# EAGLE design Main Board (EAGLE 9.4.2)
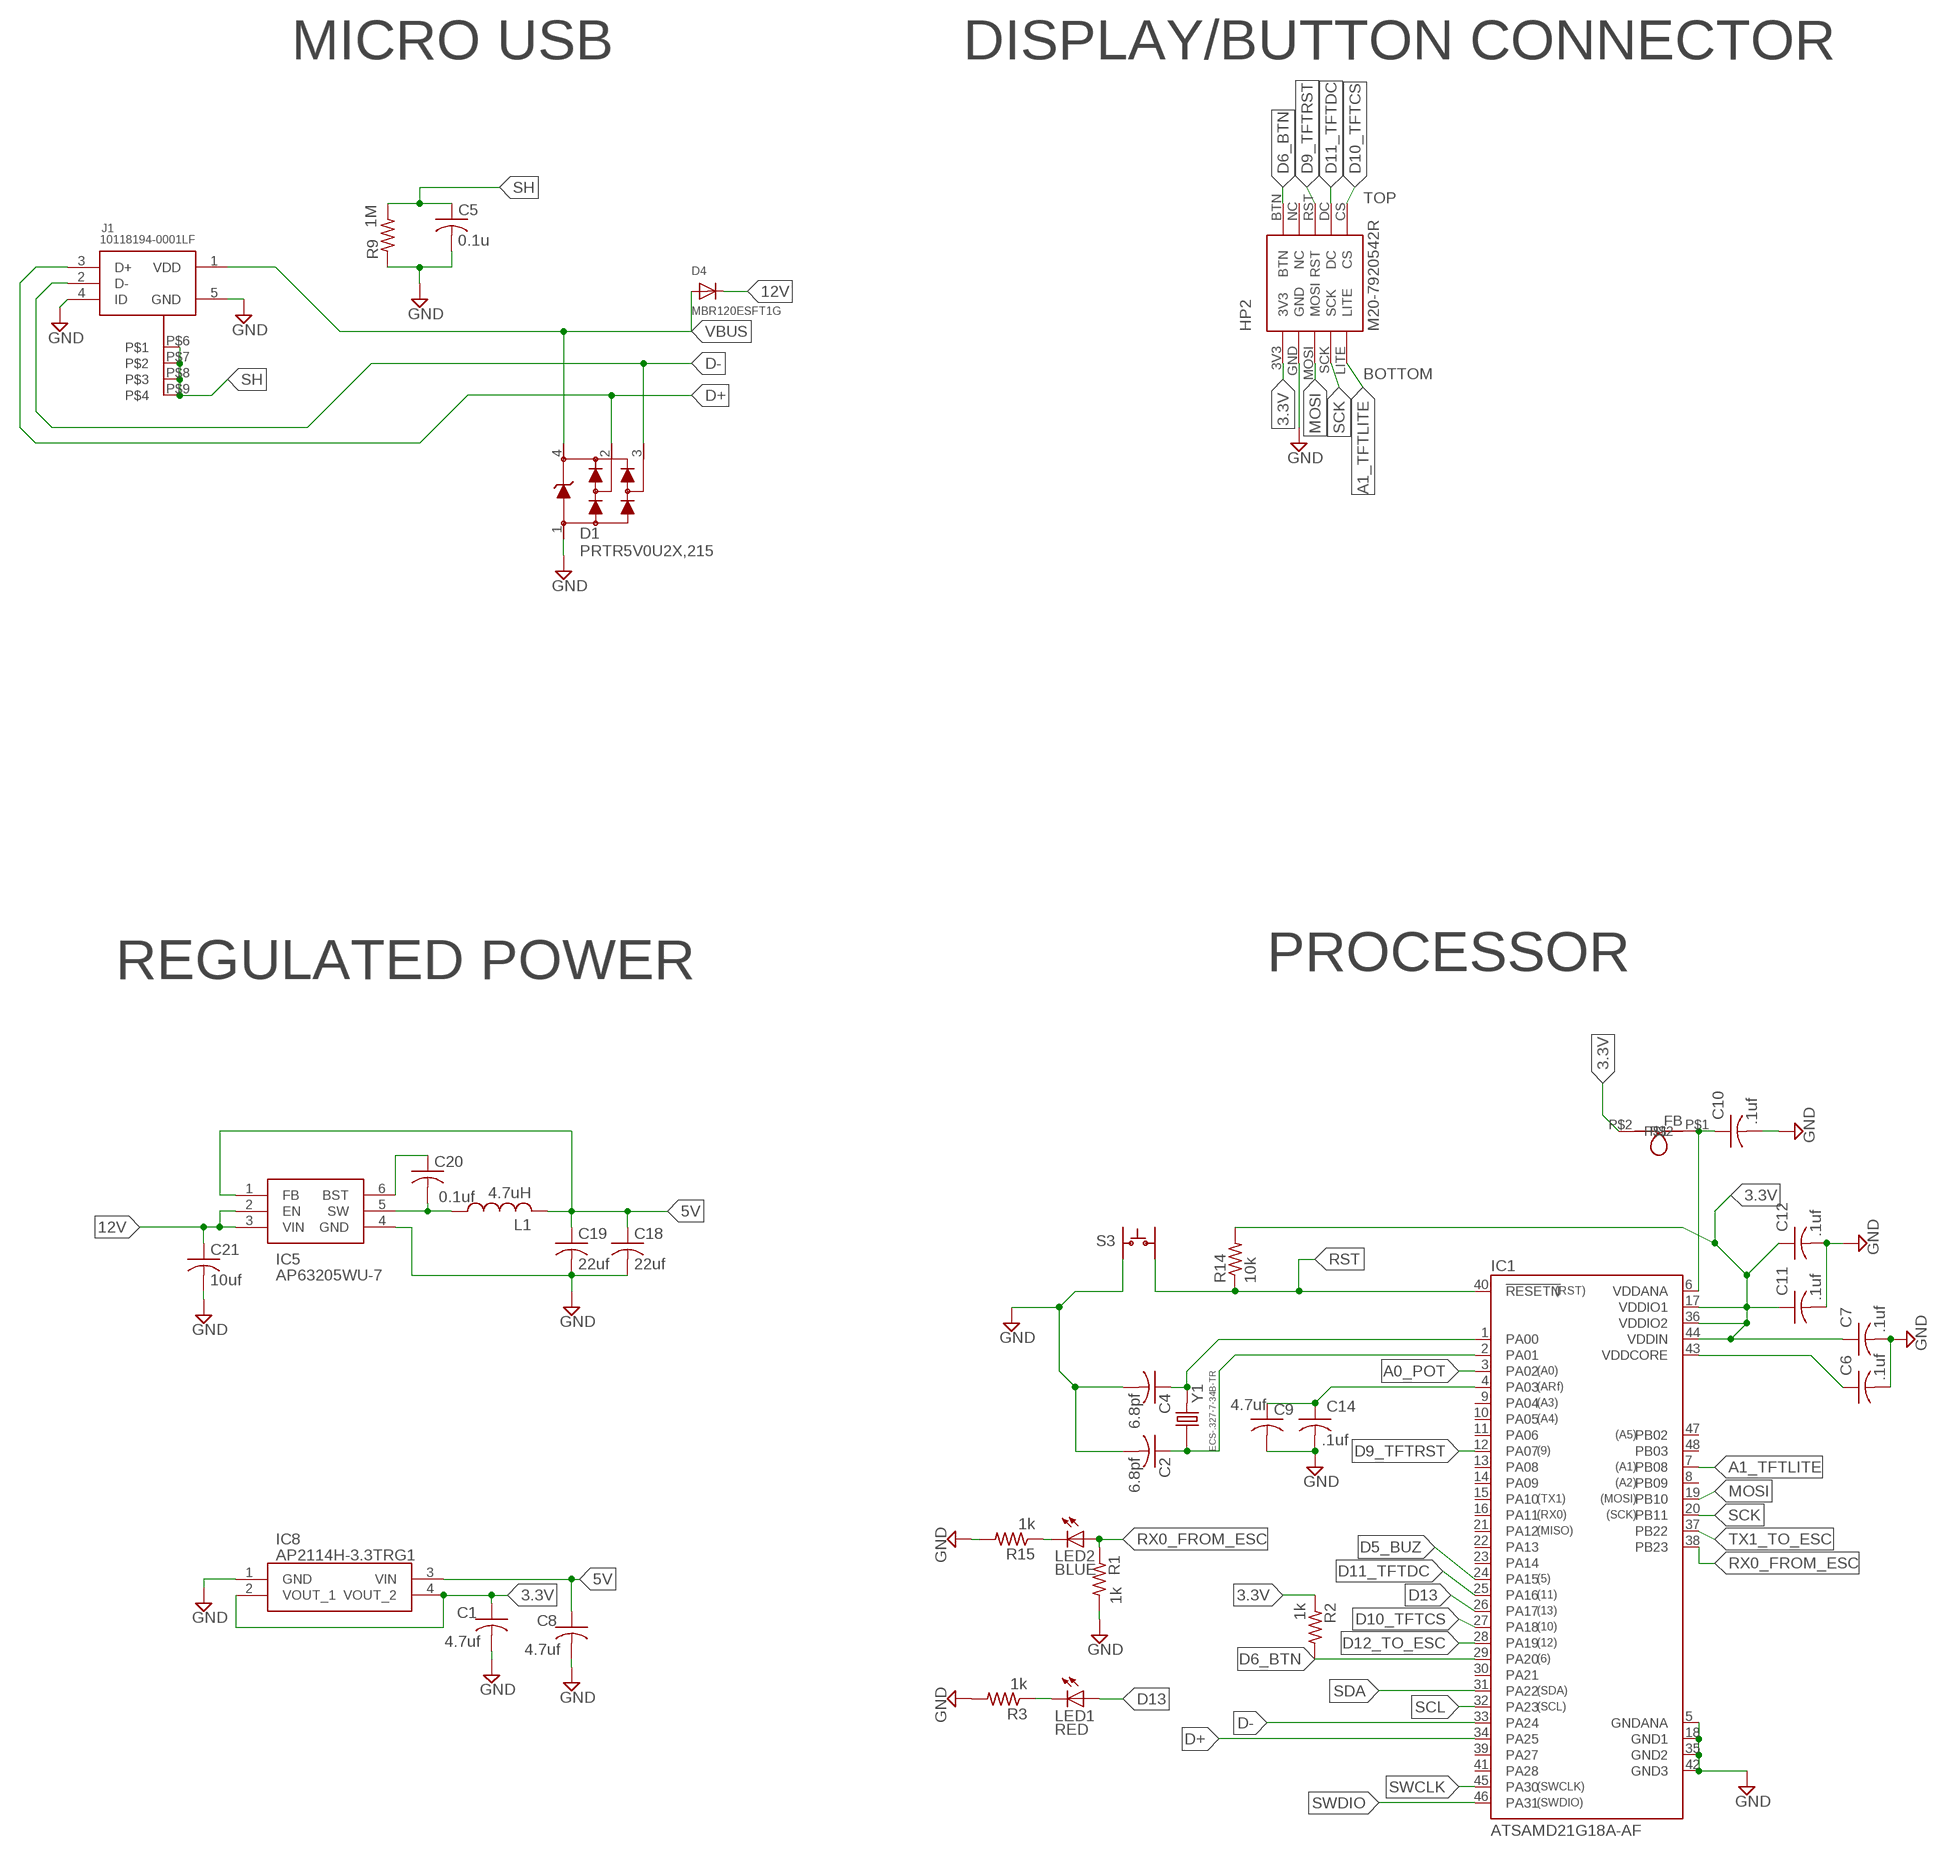
[diagram p0: schematic, sheet 1, part 1 of 2]
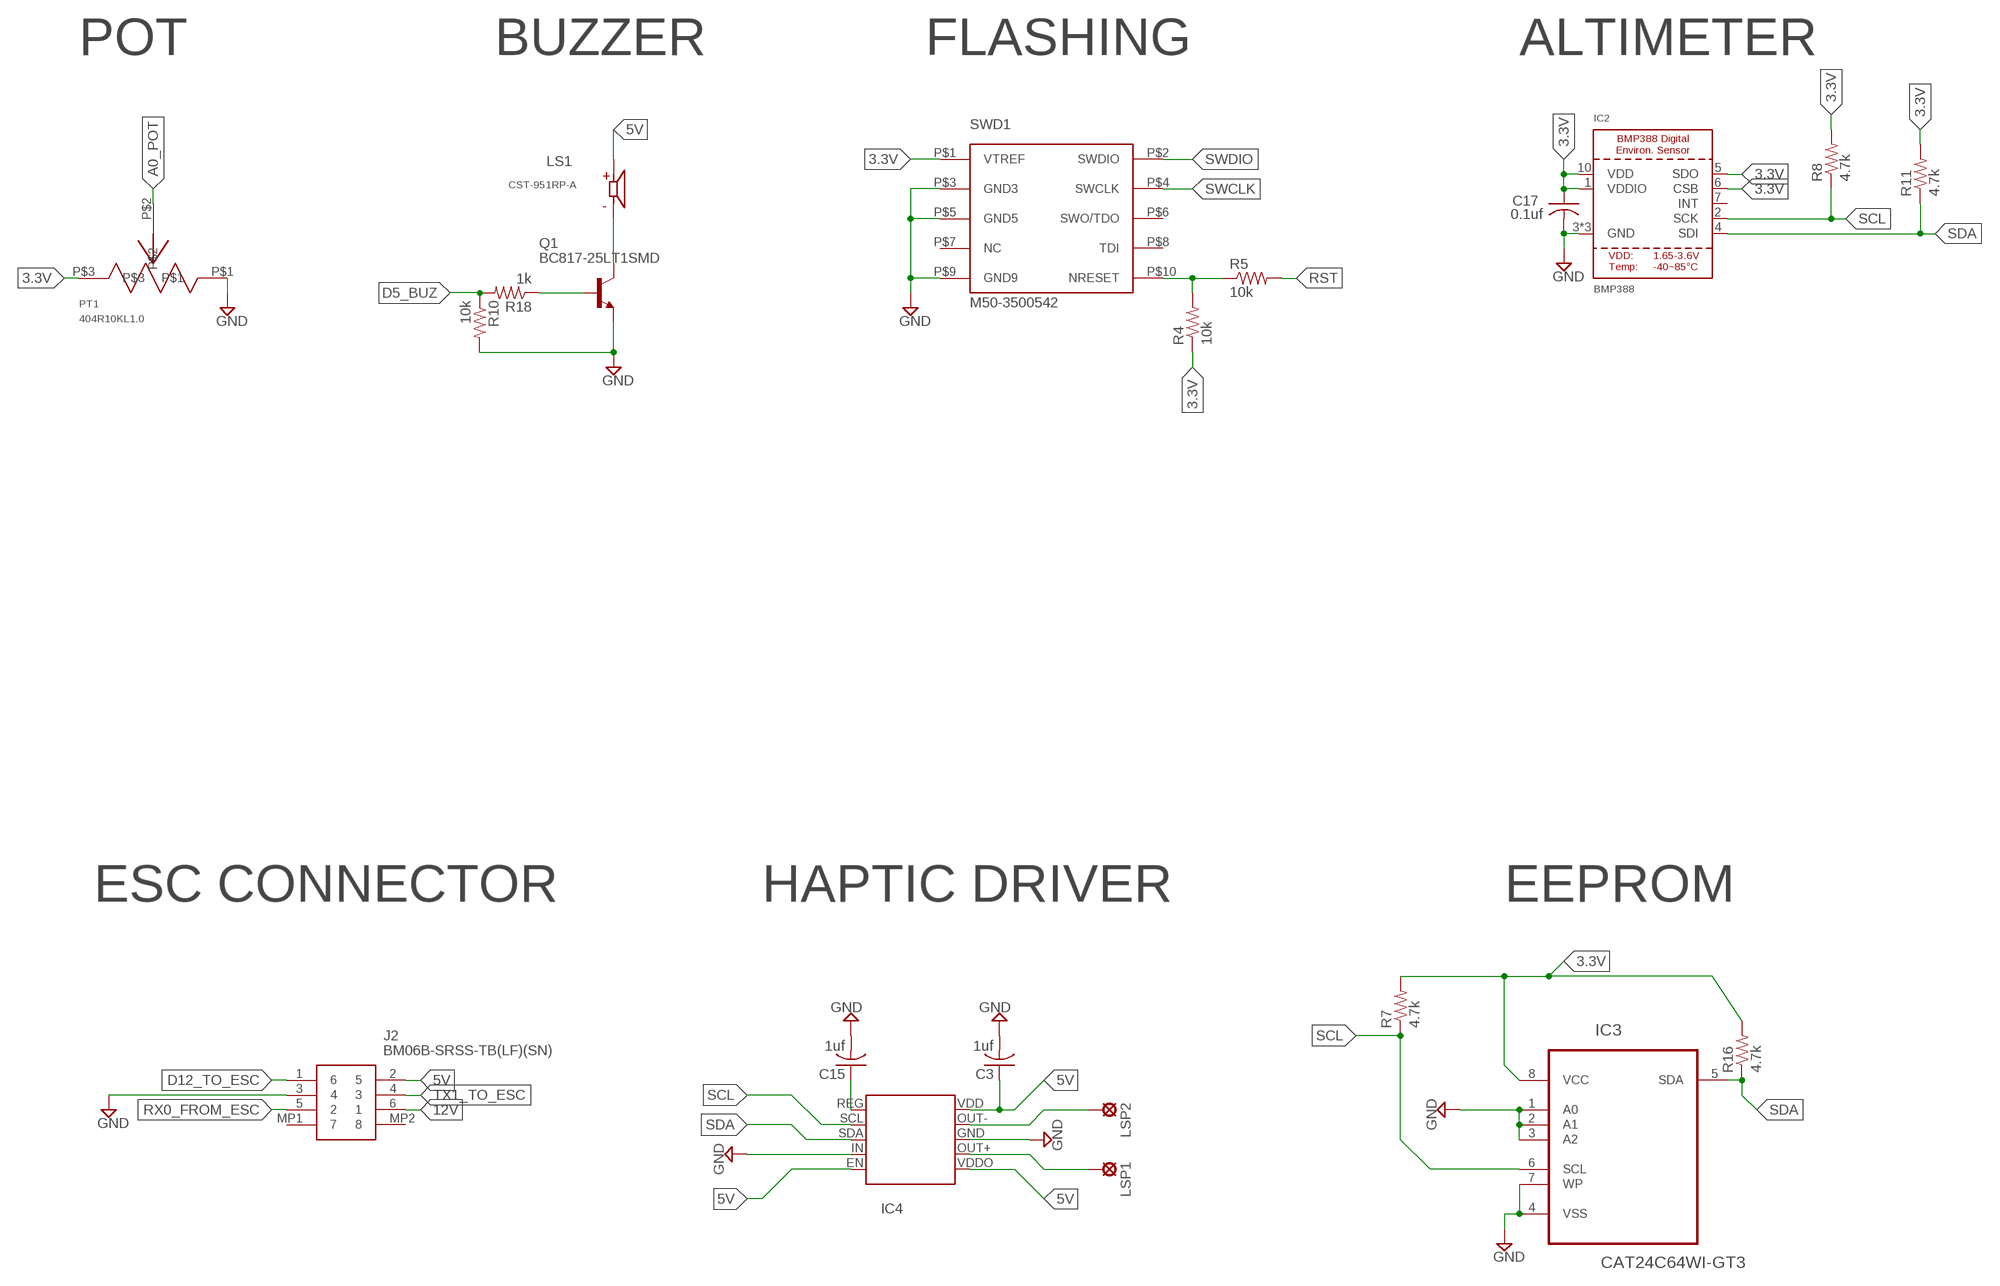
[diagram p1: schematic, sheet 1, part 2 of 2]

## Parts
C1  4.7uf  C-USC0402  [C0402]
C2  6.8pf  C-USC0402  [C0402]
C3  1uf  C-USC0402  [C0402]
C4  6.8pf  C-USC0402  [C0402]
C5  0.1u  C-USC0402  [C0402]
C6  .1uf  C-USC0402  [C0402]
C7  .1uf  C-USC0402  [C0402]
C8  4.7uf  C-USC0402  [C0402]
C9  4.7uf  C-USC0402  [C0402]
C10  .1uf  C-USC0402  [C0402]
C11  .1uf  C-USC0402  [C0402]
C12  .1uf  C-USC0402  [C0402]
C14  .1uf  C-USC0402  [C0402]
C15  1uf  C-USC0402  [C0402]
C17  0.1uf  C-USC0402  [C0402]
C18  22uf  C-USC0603  [C0603]
C19  22uf  C-USC0603  [C0603]
C20  0.1uf  C-USC0402  [C0402]
C21  10uf  C-USC0805  [C0805]
D1  PRTR5V0U2X,215  [SOT143B]
D4  MBR120ESFT1G  DIODE_SOD-123FL  [SOD-123FL]
FB  BLM18PG471SN1D  FERRITE_BEAD  [FERRITE_BEAD]
HP2  M20-7920542R  [M20-7920542R]
IC1  ATSAMD21G18A-AF  [QFP50P900X900X120-48N]
IC2  BMP388  [BMP388]
IC3  CAT24C64WI-GT3  [SOIC127P600X175-8N]
IC4  DRV2605  [DRV2605]
IC5  AP63205WU-7  [SOT95P280X100-6N]
IC8  AP2114H-3.3TRG1  [SOT230P700X180-4N]
J1  10118194-0001LF  [FRAMATOME_10118194-0001LF]
J2  BM06B-SRSS-TB(LF)(SN)  [BM06BSRSSTBLFSN]
L1  4.7uH  L-USL1812  [L1812]
LED1  RED  LEDCHIP-LED0603  [CHIP-LED0603]
LED2  BLUE  LEDCHIP-LED0603  [CHIP-LED0603]
LS1  CST-951RP-A  [CUI_CST-951RP-A]
LSP1  SE14  [SE14]
LSP2  SE14  [SE14]
PT1  404R10KL1.0  [404R10KL1.0]
Q1  BC817-25LT1SMD  [SOT23-BEC]
R1  1k  R-US_R0402  [R0402]
R2  1k  R-US_R0402  [R0402]
R3  1k  R-US_R0402  [R0402]
R4  10k  R-US_R0402  [R0402]
R5  10k  R-US_R0402  [R0402]
R7  4.7k  R-US_R0402  [R0402]
R8  4.7k  R-US_R0402  [R0402]
R9  1M  R-US_R0402  [R0402]
R10  10k  R-US_R0402  [R0402]
R11  4.7k  R-US_R0402  [R0402]
R14  10k  R-US_R0402  [R0402]
R15  1k  R-US_R0402  [R0402]
R16  4.7k  R-US_R0402  [R0402]
R18  1k  R-US_R0402  [R0402]
S3  KMR231NG LFS  TACTILE_SWITCH  [TATILE_SWITCH]
SWD1  M50-3500542  [M50-3500542]
Y1  ECS-.327-7-34B-TR  [XTAL_ECS-.327-12.5-34B-C-TR]

## Nets
3.3V: C1.1 C7.1 C11.1 C12.1 C17.1 FB.P$2 HP2.3V3 IC1.17(VDDIO1) IC1.36(VDDIO2) IC1.44(VDDIN) IC2.1(VDDIO) IC2.5(SDO) IC2.6(CSB) IC2.10(VDD) IC3.8(VCC) IC8.2(VOUT_1) IC8.4(VOUT_2) PT1.P$3 R2.1 R4.1 R7.2 R8.2 R11.2 R14.2 R16.2 SWD1.P$1(VTREF)
5V: C3.1 C8.1 C18.1 C19.1 IC4.EN IC4.VDD IC4.VDDO IC5.1(FB) IC8.3(VIN) J2.2 L1.2 LS1.P
12V: C21.1 D4.C IC5.2(EN) IC5.3(VIN) J2.6
A0_POT: IC1.3(PA02) PT1.P$2
A1_TFTLITE: HP2.LITE IC1.7(PB08)
D5_BUZ: IC1.24(PA15) R10.1 R18.2
D6_BTN: HP2.BTN IC1.29(PA20) R2.2
D9_TFTRST: HP2.RST IC1.12(PA07)
D10_TFTCS: HP2.CS IC1.27(PA18)
D11_TFTDC: HP2.DC IC1.25(PA16)
D12_TO_ESC: IC1.28(PA19) J2.1
D13: IC1.26(PA17) LED1.A
D+: D1.2 IC1.34(PA25) J1.3(D+)
D-: D1.3 IC1.33(PA24) J1.2(D-)
GND: C1.2 C2.2 C3.2 C4.2 C5.2 C6.2 C7.2 C8.2 C9.2 C10.2 C11.2 C12.2 C14.2 C15.2 C17.2 C18.2 C19.2 C21.2 D1.1 HP2.GND IC1.5(GNDANA) IC1.18(GND1) IC1.35(GND2) IC1.42(GND3) IC2.3(GND) IC2.8(GND) IC2.9(GND) IC3.1(A0) IC3.2(A1) IC3.3(A2) IC3.4(VSS) IC3.7(WP) IC4.GND IC4.IN IC5.4(GND) IC8.1(GND) J1.4(ID) J1.5(GND) J2.3 PT1.P$1 Q1.E R1.2 R3.2 R9.1 R10.2 R15.2 S3.P$3 SWD1.P$3(GND3) SWD1.P$5(GND5) SWD1.P$9(GND9)
MOSI: HP2.MOSI IC1.19(PB10)
N$1: C6.1 IC1.43(VDDCORE)
N$2: LED1.C R3.1
N$4: C4.1 IC1.1(PA00) Y1.2
N$6: C2.1 IC1.2(PA01) Y1.1
N$8: C10.1 FB.P$1 IC1.6(VDDANA)
N$9: R4.2 R5.1 SWD1.P$10(NRESET)
N$10: C20.2 IC5.5(SW) L1.1
N$11: C20.1 IC5.6(BST)
N$14: LED2.C R15.1
N$17: IC4.OUT- LSP2.MP
N$24: C9.1 C14.1 IC1.4(PA03)
N$25: Q1.B R18.1
N$26: LS1.M Q1.C
N$27: C15.1 IC4.REG
N$28: IC4.OUT+ LSP1.MP
RST: IC1.40(!RESETN) R5.2 R14.1 S3.P$4
RX0_FROM_ESC: IC1.38(PB23) J2.5 LED2.A R1.1
SCK: HP2.SCK IC1.20(PB11)
SCL: IC1.32(PA23) IC2.2(SCK) IC3.6(SCL) IC4.SCL R7.1 R8.1
SDA: IC1.31(PA22) IC2.4(SDI) IC3.5(SDA) IC4.SDA R11.1 R16.1
SH: C5.1 J1.P$6 J1.P$7 J1.P$8 J1.P$9 R9.2
SWCLK: IC1.45(PA30) SWD1.P$4(SWCLK)
SWDIO: IC1.46(PA31) SWD1.P$2(SWDIO)
TX1_TO_ESC: IC1.37(PB22) J2.4
VBUS: D1.4 D4.A J1.1(VDD)
Unconnected: HP2.NC IC1.8(PB09) IC1.9(PA04) IC1.10(PA05) IC1.11(PA06) IC1.13(PA08) IC1.14(PA09) IC1.15(PA10) IC1.16(PA11) IC1.21(PA12) IC1.22(PA13) IC1.23(PA14) IC1.30(PA21) IC1.39(PA27) IC1.41(PA28) IC1.47(PB02) IC1.48(PB03) IC2.7(INT) J2.MP1 J2.MP2 S3.P$1 S3.P$2 SWD1.P$6(SWO/TDO) SWD1.P$7(NC) SWD1.P$8(TDI)

## Notes on the sheet
- MICRO USB | DISPLAY/BUTTON CONNECTOR | POT | BUZZER | FLASHING | ALTIMETER
- REGULATED POWER | PROCESSOR | ESC CONNECTOR | HAPTIC DRIVER | EEPROM

## Library data of the parts
C1-C12 C14 C15 C17-C21 = rcl:C-US: CAPACITOR, American symbol; SPICEPREFIX: C
D1 = PRTR5V0U2X_215:PRTR5V0U2X,215: Ultra low capacitance double rail-to-rail ESD protection diode; AVAILABILITY: Good; DESCRIPTION: PRTR5V0U2X - Ultra low capacitance double rail-to-rail ESD protection diode; MF: Nexperia; MP: PRTR5V0U2X,215; PACKAGE: SOT-143 Nexperia; PRICE: 0.26 USD
D4 = adafruit:DIODE: Diode SMADIODE - SMA Surface Mount Package 20V 1A Schottky Diode Digikey: 641-1014-6-ND DO-1N4148 - Through Hole Small Current Diode SOD-123 20V 1 A (.5mV Vf) Schottky Diode - Digikey: MBRX120TPMSCT-ND SOD-323 10V 570mA (.38mV Vf, 3ns) Schottky Diode - Digikey: ZLLS410CT-ND SOD-523 30V 30mA Schottky Diode (RB751S-40TE61) - Digikey: RB751S-40TE61CT-ND SOT23-R/W - SOT23 Package (R = Solder Paste/Reflow Ovens, W = Hand-Soldering) BAT54Film 40V 300mA - Digikey: 497-7162-1-ND
FB = Cucchiara:FERRITE_BEAD
HP2 = M20-7920542R:M20-7920542R
IC1 = ATSAMD21G18A-AF:ATSAMD21G18A-AF: Cortex-M0+, 256KB FLASH, 32KB SRAM, USB, DMA, T&R - 48TQFP IND TEMP, GREEN, 1.6-3.6V, 48MHz; DESCRIPTION: MCU 32-Bit SAM D21G ARM Cortex M0+ RISC 256KB Flash 3.3V 48-Pin TQFP Tray; DIGI-KEY_PART_NUMBER: ATSAMD21G18A-AF-ND; DIGI-KEY_PURCHASE_URL: https://www.digikey.com/product-detail/en/microchip-technology/ATSAMD21G18A-AF/ATSAMD21G18A-AF-ND/5057238?utm_source=snapeda&utm_medium=aggregator&utm_campaign=symbol; MF: Microchip; MP: ATSAMD21G18A-AF; PACKAGE: TQFP-48 Microchip
IC2 = microbuilder:BMP388
IC3 = CAT24C64WI-GT3:CAT24C64WI-GT3: 64 kb I2C CMOS Serial EEPROM; AVAILABILITY: Unavailable; DESCRIPTION: CAT24C64 Series 64 Kb _8K X 8_ 1.8 - 5.5 V I2C CMOS Serial EEPROM - SOIC-8; MF: ON Semiconductor; MP: CAT24C64WI-GT3; PACKAGE: SOIC-8 ON Semiconductor; PRICE: None
IC4 = Zachs E libraries:DRV2605
IC5 = AP63205WU-7:AP63205WU-7: Switching Voltage Regulators DCDC Conv HV Buck TSOT26 T&R 3K Source: Datasheet <https://www.diodes.com/assets/Datasheets/AP63200-AP63201-AP63203-AP63205.pdf>; DESCRIPTION: Switching Voltage Regulators DCDC Conv HV Buck TSOT26 T&R 3K; HEIGHT: 1mm; MANUFACTURER_NAME: Diodes Inc.; MANUFACTURER_PART_NUMBER: AP63205WU-7; MOUSER_PART_NUMBER: 621-AP63205WU-7; MOUSER_PRICE-STOCK: https://www.mouser.com/Search/Refine.aspx?Keyword=621-AP63205WU-7
IC8 = AP2114H-3.3TRG1:AP2114H-3.3TRG1: 1A 3.3V Low Noise LDO Regulator SOT223 DiodesZetex AP2114H-3.3TRG1, LDO Voltage Regulator, 1 (Min)A, 3.3 V +/-1.5%, 2.5 6 Vin, 3-Pin SOT-223 Source: Datasheet <http://uk.rs-online.com/web/p/products/8283528>; ALLIED_NUMBER: 70550988; ALLIED_PRICE-STOCK: https://www.alliedelec.com/diodes-inc-ap2114h-3-3trg1/70550988/; DESCRIPTION: 1A 3.3V Low Noise LDO Regulator SOT223 DiodesZetex AP2114H-3.3TRG1, LDO Voltage Regulator, 1 (Min)A, 3.3 V +/-1.5%, 2.5 6 Vin, 3-Pin SOT-223; HEIGHT: 1.8mm; MANUFACTURER_NAME: Diodes Inc.; MANUFACTURER_PART_NUMBER: AP2114H-3.3TRG1; MOUSER_PART_NUMBER: 621-AP2114H-3.3TRG1; MOUSER_PRICE-STOCK: https://www.mouser.com/Search/Refine.aspx?Keyword=621-AP2114H-3.3TRG1; RS_PART_NUMBER: 8283528P; RS_PRICE-STOCK: http://uk.rs-online.com/web/p/products/8283528P
J1 = 10118194-0001LF:10118194-0001LF: Conn Micro USB Type B RCP 5 POS 0.65mm Solder RA SMD 5 Terminal 1 Port T/R; AVAILABILITY: Unavailable; DESCRIPTION: Micro Usb, 2.0 Type b, Rcpt, Smt; MF: Amphenol FCI; MP: 10118194-0001LF; PACKAGE: None; PRICE: None
J2 = BM06B-SRSS-TB(LF)(SN):BM06B-SRSS-TB(LF)(SN): connector,multipole PCB use,BM06B-SRSS-T JST SH Series, 1mm Pitch 6 Way 1 Row Straight PCB Header, Solder Termination, 1A Source: Datasheet <http://docs-emea.rs-online.com/webdocs/13ce/0900766b813ce45e.pdf>; DESCRIPTION: connector,multipole PCB use,BM06B-SRSS-T JST SH Series, 1mm Pitch 6 Way 1 Row Straight PCB Header, Solder Termination, 1A; HEIGHT: 4.25mm; MANUFACTURER_NAME: JST (JAPAN SOLDERLESS TERMINALS); MANUFACTURER_PART_NUMBER: BM06B-SRSS-TB(LF)(SN); RS_PART_NUMBER: 5468782; RS_PRICE-STOCK: http://uk.rs-online.com/web/p/products/5468782
L1 = rcl:L-US: INDUCTOR, American symbol; SPICEPREFIX: L
LED1 LED2 = led:LED: LED OSRAM: - CHIPLED LG R971, LG N971, LY N971, LG Q971, LY Q971, LO R971, LY R971 LH N974, LH R974 LS Q976, LO Q976, LY Q976 LO Q996 - Hyper CHIPLED LW Q18S LB Q993, LB Q99A, LB R99A - SideLED LS A670, LO A670, LY A670, LG A670, LP A670 LB A673, LV A673, LT A673, LW A673 LH A674 LY A675 LS A676, LA A676, LO A676, LY A676, LW A676 LS A679, LY A679, LG A679 - Hyper Micro SIDELED® LS Y876, LA Y876, LO Y876, LY Y876 LT Y87S - SmartLED LW L88C, LW L88S LB L89C, LB L89S, LG L890 LS L89K, LO L89K, LY L89K LS L896, LA L896, LO L896, LY L896 - TOPLED LS T670, LO T670, LY T670, LG T670, LP T670 LSG T670, LSP T670, LSY T670, LOP T670, LYG T670 LG T671, LOG T671, LSG T671 LB T673, LV T673, LT T673, LW T673 LH T674 LS T676, LA T676, LO T676, LY T676, LB T676, LH T676, LSB T676, LW T676 LB T67C, LV T67C, LT T67C, LS T67K, LO T67K, LY T67K, LW E67C LS E67B, LA E67B, LO E67B, LY E67B, LB E67C, LV E67C, LT E67C LW T67C LS T679, LY T679, LG T679 LS T770, LO T770, LY T770, LG T770, LP T770 LB T773, LV T773, LT T773, LW T773 LH T774 LS E675, LA E675, LY E675, LS T675 LS T776, LA T776, LO T776, LY T776, LB T776 LHGB T686 LT T68C, LB T68C - Hyper Mini TOPLED® LB M676 - Mini TOPLED Santana® LG M470 LS M47K, LO M47K, LY M47K Source: http://www.osram.convergy.de LUXEON: - LUMILED® LXK2-PW12-R00, LXK2-PW12-S00, LXK2-PW14-U00, LXK2-PW14-V00 LXK2-PM12-R00, LXK2-PM12-S00, LXK2-PM14-U00 LXK2-PE12-Q00, LXK2-PE12-R00, LXK2-PE12-S00, LXK2-PE14-T00, LXK2-PE14-U00 LXK2-PB12-K00, LXK2-PB12-L00, LXK2-PB12-M00, LXK2-PB14-N00, LXK2-PB14-P00, LXK2-PB14-Q00 LXK2-PR12-L00, LXK2-PR12-M00, LXK2-PR14-Q00, LXK2-PR14-R00 LXK2-PD12-Q00, LXK2-PD12-R00, LXK2-PD12-S00 LXK2-PH12-R00, LXK2-PH12-S00 LXK2-PL12-P00, LXK2-PL12-Q00, LXK2-PL12-R00 Source: www.luxeon.com KINGBRIGHT: KA-3528ASYC Source: www.kingbright.com
LS1 = CST-951RP-A:CST-951RP-A: 9 mm, 5 V, 85 dB, Through Hole, Side Port, Magnetic Audio Transducer Buzzer; AVAILABILITY: Unavailable; CUI_PURCHASE_URL: https://www.cui.com/product/audio/buzzers/audio-transducers/magnetic/cst-951rp-a?utm_source=snapeda.com&utm_medium=referral&utm_campaign=snapedaBOM; DESCRIPTION: 9 mm, 5 V, 85 dB, Through Hole, Side Port, Magnetic Audio Transducer Buzzer; MF: CUI Inc.; MP: CST-951RP-A; PACKAGE: CUI; PRICE: None
LSP1 LSP2 = solpad:SE14: SOLDER PAD E1553, drill 1,4mm, distributor Buerklin, 07F820
PT1 = 404R10KL1.0:404R10KL1.0; POT: 10K
Q1 = transistor-npn:BC817*: NPN Transistor
R1-R5 R7-R11 R14-R16 R18 = rcl:R-US_: RESISTOR, American symbol; SPICEPREFIX: R
S3 = Zachs E libraries:TACTILE_SWITCH
SWD1 = Braedin's Eagle Libraries:M50-3500542; SWD: M50-3500542
Y1 = ECS-.327-7-34B-TR:ECS-.327-7-34B-TR: Crystal 2-SMD, No Lead; AVAILABILITY: Good; DESCRIPTION: ECX-31B Series 32.768 kHz ±20 ppm 7 pF -40 to +85 °C SMT Tuning Fork Crystal; MF: ECS International; MP: ECS-.327-7-34B-TR; PACKAGE: SMD-2 ECS International; PRICE: 0.45 USD

## Net classes
0 default: width 0.152 mm
1 3.3V: width 0.254 mm
3 GND: width 0.254 mm

## Board
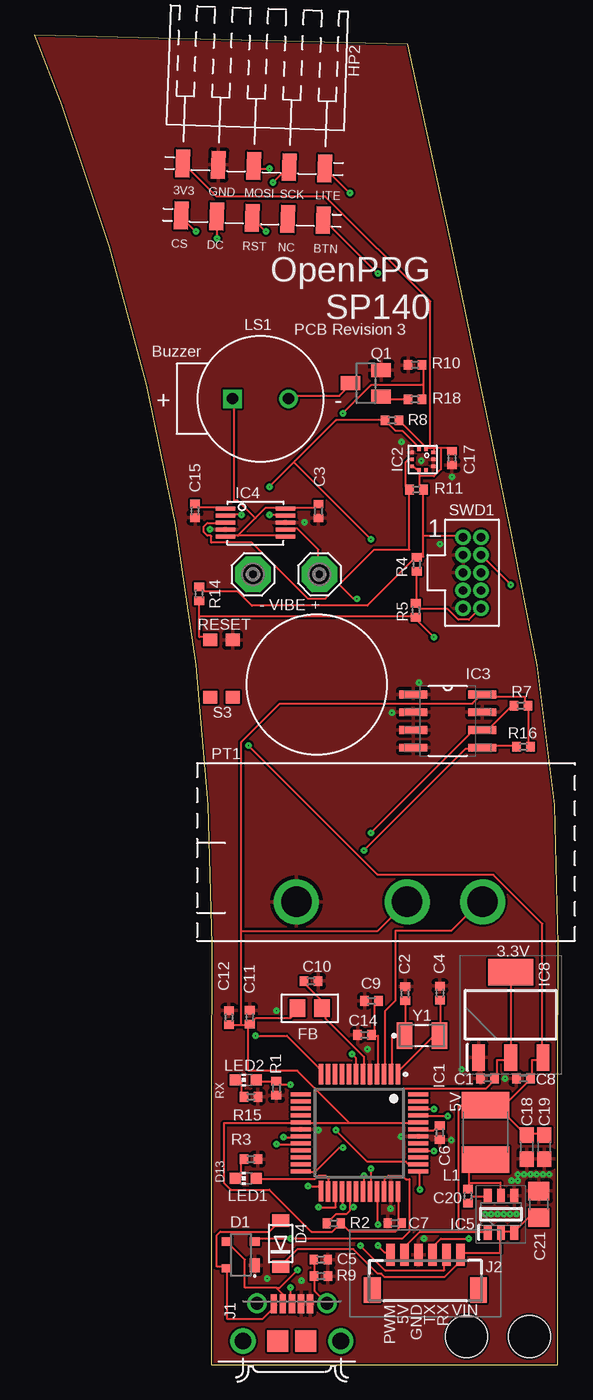
[diagram p2: board, top side]
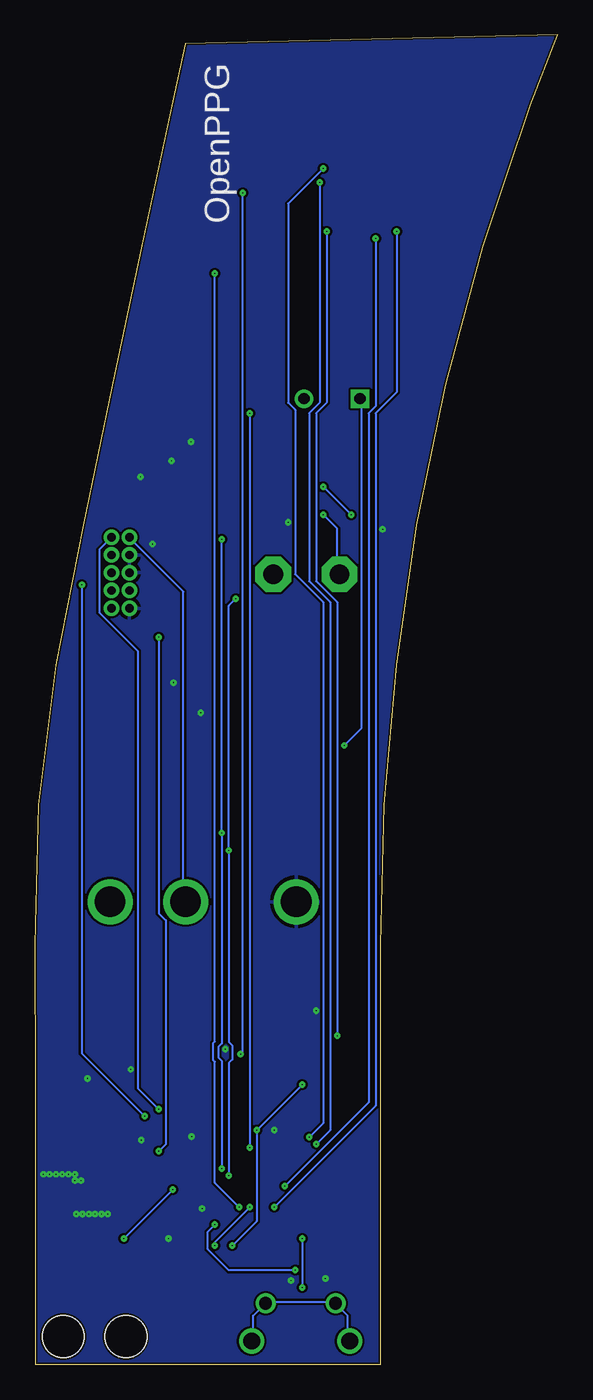
[diagram p3: board, bottom side, seen from below]

Size 37.35 x 95.05 mm. Coordinates in mm from the lower left corner, seen from the top.
Outline: 0,95.05 26.6,94.4 27.57,90 29.73,80 31.83,70 33.88,60 35.87,50 37.1,40 37.35,30 37.33,20 37.33,0 12.63,0 12.63,20 12.65,30 12.37,40 11.51,50 10.05,60 7.99,70 5.3,80 1.95,90 0,95.05
Copper layers (1*16): Top 0.035mm / dielectric 1.5mm / Bottom 0.035mm
Design rules "default *": minimum track width 2mil, minimum drill 2mil, track to track 6mil, track to pad 6mil, pad to pad 6mil, via to via 6mil, smd to smd 6mil, copper to edge 0.149859375mm, drill to drill 8mil, minimum pad ring 10mil, minimum via ring 8mil, stop-mask expansion 3mil, vias tented up to drill 0mil, thermal gap 10mil
Holes 3 mm at 30.85,2 35.33,2

### Footprints (pad centres in the part's own frame; a part is rotated, then mirrored left to right if it is on the bottom)
C0402 = smd 0.6 x 0.7: 1 -0.5,0; 2 0.5,0
C0603 = smd 1.1 x 1: 1 -0.85,0; 2 0.85,0
C0805 = smd 1.3 x 1.5: 1 -0.95,0; 2 0.95,0
SOT143B = smd 1 x 0.7: 1 -0.75,-1 | smd 0.6 x 0.7: 2 0.95,-1; 3 0.95,1; 4 -0.95,1
SOD-123FL = smd 0.91 x 1.22: A 1.637,0; C -1.637,0
FERRITE_BEAD = smd 1.1 x 1.25: P$1 -0.875,0; P$2 0.875,0
M20-7920542R = smd 1 x 2: 3V3 0,4.125; BTN 10.16,0.425; CS 0,0.425; DC 2.54,0.425; GND 2.54,4.125; LITE 10.16,4.125; MOSI 5.08,4.125; NC 7.62,0.425; RST 5.08,0.425; SCK 7.62,4.125
QFP50P900X900X120-48N = smd 1.45 x 0.3: 1 -4.2,2.75; 2 -4.2,2.25; 3 -4.2,1.75; 4 -4.2,1.25; 5 -4.2,0.75; 6 -4.2,0.25; 7 -4.2,-0.25; 8 -4.2,-0.75; 9 -4.2,-1.25; 10 -4.2,-1.75; 11 -4.2,-2.25; 12 -4.2,-2.75; 25 4.17,-2.75; 26 4.2,-2.25; 27 4.2,-1.75; 28 4.2,-1.25; 29 4.2,-0.75; 30 4.2,-0.25; 31 4.2,0.25; 32 4.2,0.75; 33 4.2,1.25; 34 4.2,1.75; 35 4.2,2.25; 36 4.2,2.75 | smd 0.3 x 1.45: 13 -2.75,-4.2; 14 -2.25,-4.2; 15 -1.75,-4.2; 16 -1.25,-4.2; 17 -0.75,-4.2; 18 -0.25,-4.2; 19 0.25,-4.2; 20 0.75,-4.2; 21 1.25,-4.2; 22 1.75,-4.2; 23 2.25,-4.2; 24 2.75,-4.2; 37 2.75,4.2; 38 2.25,4.2; 39 1.75,4.2; 40 1.25,4.2; 41 0.75,4.2; 42 0.25,4.2; 43 -0.25,4.2; 44 -0.75,4.2; 45 -1.25,4.2; 46 -1.75,4.2; 47 -2.25,4.2; 48 -2.75,4.2
BMP388 = smd 0.25 x 0.275: 1 0.25,0.75; 2 -0.25,0.75; 6 -0.25,-0.75; 7 0.25,-0.75 | smd 0.275 x 0.25: 3 -0.762,0.5; 4 -0.762,0; 5 -0.762,-0.5; 8 0.762,-0.5; 9 0.762,0; 10 0.762,0.5
SOIC127P600X175-8N = smd 1.981 x 0.559: 1 -2.464,1.905; 2 -2.464,0.635; 3 -2.464,-0.635; 4 -2.464,-1.905; 5 2.464,-1.905; 6 2.464,-0.635; 7 2.464,0.635; 8 2.464,1.905
DRV2605 = smd 1.4 x 0.28: EN -2.14,-1; GND 2.14,0; IN -2.14,-0.5; OUT+ 2.14,-0.5; OUT- 2.14,0.5; REG -2.14,1; SCL -2.14,0.5; SDA -2.14,0; VDD 2.14,1; VDDO 2.14,-1
SOT95P280X100-6N = smd 1.05 x 0.55: 1 -1.3,0.95; 2 -1.3,0; 3 -1.3,-0.95; 4 1.3,-0.95; 5 1.3,0; 6 1.3,0.95
SOT230P700X180-4N = smd 1.9 x 0.9: 1 -3.05,2.3; 2 -3.05,0; 3 -3.05,-2.3 | smd 1.9 x 3.2: 4 3.05,0
FRAMATOME_10118194-0001LF = smd 0.45 x 1.35: 1 -1.3,2.675; 2 -0.65,2.675; 3 0,2.675; 4 0.65,2.675; 5 1.3,2.675 | drill 0.9: P$6 -2.5,2.7; P$7 2.5,2.7 | drill 1.2: P$8 -3.5,0; P$9 3.5,0 | smd 1.5 x 1.55: P$10 -1,0; P$11 1,0
BM06BSRSSTBLFSN = smd 0.6 x 1.55: 1 2.5,-1.65; 2 1.5,-1.65; 3 0.5,-1.65; 4 -0.5,-1.65; 5 -1.5,-1.65; 6 -2.5,-1.65 | smd 1.2 x 1.8: MP1 -3.8,0.875; MP2 3.8,0.875
L1812 = smd 1.9 x 3.4: 1 -1.95,0; 2 1.95,0
CHIP-LED0603 = smd 0.8 x 0.8: A 0,-0.75; C 0,0.75
CUI_CST-951RP-A = drill 0.8: M 2,0 | drill 0.8 square: P -2,0
SE14 = drill 1.397 pad 2.54 octagon: MP 0,0
404R10KL1.0 = drill 2.2: P$1 7.1,2.8; P$2 20.4,2.8; P$3 15,2.8
SOT23-BEC = smd 1 x 1.4: B -0.95,-1.1; C 0,1.1; E 0.95,-1.1
R0402 = smd 0.6 x 0.7: 1 -0.5,0; 2 0.5,0
TATILE_SWITCH = smd 0.9 x 1: P$1 2.05,0.8; P$2 2.05,-0.8; P$3 -2.05,0.8; P$4 -2.05,-0.8
M50-3500542 = drill 0.6: P$1 0,2.54; P$2 1.27,2.54; P$3 0,1.27; P$4 1.27,1.27; P$5 0,0; P$6 1.27,0; P$7 0,-1.27; P$8 1.27,-1.27; P$9 0,-2.54; P$10 1.27,-2.54
XTAL_ECS-.327-12.5-34B-C-TR = smd 1.1 x 1.9: 1 -1.25,0; 2 1.25,0

### Placement (x,y rotation side)
C1  32.35,20.45 180 top
C2  26.45,26.52 90 top
C3  20.26,61.01 270 top
C4  28.94,26.55 90 top
C5  20.42,7.5 0 top
C6  28.93,16.57 270 top
C7  25.71,10.12 180 top
C8  34.9,20.45 180 top
C9  24.05,25.99 180 top
C10  19.73,27.41 0 top
C11  15.35,24.82 90 top
C12  13.86,24.8 90 top
C14  23.55,23.57 180 top
C15  11.44,61.04 270 top
C17  29.8,64.8 270 top
C18  35.15,15.55 270 top
C19  36.4,15.55 270 top
C20  30.95,12.05 90 top
C21  36,11.45 90 top
D1  14.71,7.83 90 top
D4  17.55,8.65 90 top
FB  19.64,25.47 180 top
HP2  10.43,81.74 358 top
IC1  23.19,16.57 270 top
IC2  27.7,64.7 0 top
IC3  29.5,46 0 top
IC4  15.75,60.2 0 top
IC5  33.3,10.75 90 top
IC8  34,25 90 top
J1  18.36,1.68 0 top
J2  27.9,6.2 180 top
L1  32.2,16.6 90 top
LED1  15.07,13.31 90 top
LED2  15.07,20.34 90 top
LS1  16.12,69.04 0 top
LSP1  20.32,56.49 0 top
LSP2  15.58,56.49 0 top
PT1  11.59,30.28 0 top
Q1  23.64,70.15 90 top
R1  17.25,19.75 270 top
R2  21.35,10.1 180 top
R3  15.43,14.68 0 top
R4  27.28,57.2 270 top
R5  27.22,53.92 270 top
R7  34.73,47.1 0 top
R8  25.5,67.5 0 top
R9  20.43,6.32 180 top
R10  27.17,71.46 180 top
R11  27.25,62.55 0 top
R14  11.73,55.11 90 top
R15  15.43,19.13 0 top
R16  34.91,44.16 0 top
R18  27.15,68.99 0 top
S3  13.32,49.75 270 top
SWD1  30.6,56.6 0 top
Y1  27.65,23.52 0 top

### Tracks (layer width: path | path; a pad name or v marks a point on that pad's centre or on a via)
3.3V
  Top 0.152: 27.5,63.5 27.5,62.75 27.75,62.75 R11.2 27.75,59.25 | 27.5,63.5 27.5,64 | 27.5,64 27.25,64 27,64.25 IC2.5 | 27.5,64 IC2.6 | R14.2 11.75,55.5 12,55.25 14.5,55.25 15.5,54.25 23.75,54.25 27,57.5 27.25,57.5 R4.1 27.5,57.75 27.75,57.75 27.75,59.25 | 27.75,59.25 30.5,59.25 SWD1.P$1 | 29,65.5 29.75,65.5 C17.1 | 29,65.5 28.5,65.5 | 28.5,65.5 28.25,65.5 | 28.25,65.5 28,65.5 | 28.5,65.5 28.5,65.25 IC2.10 | 28,65.5 R8.2 | 28,65.5 IC2.1 | 28.25,65.5 28.25,76 20.75,83.5 13,83.5 10.75,85.75 HP2.3V3 | 27.5,63.5 28.5,63.5 29,64 29,65.5 | IC8.4 IC8.2 34,21.75 33,21.75 33,20.5 C1.1 32.75,20.25 32.25,19.75 20,19.75 | R16.2 35.25,44.25 35.25,47 R7.2 35,47.25 35,47.75 32,47.75 IC3.8 31.75,47.75 31.25,47.25 17.5,47.25 14.75,44.5 14.75,31 | IC1.36 26,12.25 26,10.25 C7.1 26.25,10 25.75,9.5 22.5,9.5 22,10 R2.1 21.25,9.5 19.75,9.5 16.75,12.5 14,12.5 13.5,13 13.5,17.25 18.75,17.25 IC1.17 19,17.25 22.5,17.25 | 15.25,24.25 14.75,24.25 | 14.75,24.25 14,24.25 C12.1 | FB.P$2 18.75,25.25 18.25,24.75 15.75,24.75 15.5,24.5 C11.1 15.25,24.25 | 22.5,17.25 27.25,17.25 IC1.44 | 15.25,24.25 15.25,21 18.75,21 20,19.75 | 22.5,17.25 20,19.75 | 14.75,24.25 14.75,31 | 14.75,31 24.5,31 26.5,33 PT1.P$3
  Bottom 0.152: SWD1.P$1 30.5,59 26.75,55.25 26.75,33.25 PT1.P$3
5V  (via drill 0.05)
  Top 0.152: C3.1 20,61.25 18,61.25 IC4.VDD 17.75,61.25 16.5,61.25 15.75,60.5 | 14.5,59.25 17.75,59.25 IC4.VDDO | 14.5,59.25 13.75,59.25 IC4.EN | 14.5,59.25 15.75,60.5 | 15.75,60.5 14.5,61.75 14.25,61.75 14.25,69 LS1.P | 30.25,9.5 27.5,9.5 26.5,8.5 26.5,8 J2.2 | 30.25,9.5 32.25,9.5 IC5.1 | C19.1 36.25,16.5 35.25,16.5 C18.1 35,16.5 33.25,18.25 | 33.25,18.25 33,18.5 32.25,18.5 L1.2 | 33.25,18.25 35.25,20.25 C8.1 35.5,20.5 35.5,21.75 36.25,21.75 IC8.3 36.25,22 36.25,31.5 32.75,35 24.5,35 v15.25,44.25 | 33.25,18.25 L1.2 | 30.25,9.5 30.25,18.5 32,18.5 L1.2
  Bottom 0.152: v15.25,44.25 14,45.5 14,69 LS1.P
12V
  Top 0.152: 34.25,9.5 33.5,9.5 IC5.2 33.25,9.25 33.25,8 30.5,8 J2.6 30.25,7.75 30.25,7.25 29.25,6.25 25,6.25 24.75,6.5 24.5,6.5 22.75,8.25 18.75,8.25 17.75,7.25 D4.C | 34.25,9.5 35.25,10.5 C21.1 | 34.25,9.5 IC5.3
A0_POT
  Top 0.152: IC1.3 25,21 25,25.25 25.75,26 25.75,31 29.75,31 31.75,33 PT1.P$2
A1_TFTLITE  (via drill 0.05)
  Top 0.152: v22.5,83.75 20.75,85.5 HP2.LITE | v22.65,22.2 22.94,21.91 IC1.7
  Bottom 0.152: v22.65,22.2 22.5,22.35 v22.5,83.75
D5_BUZ  (via drill 0.05)
  Top 0.152: 27.75,70 27.75,71.25 R10.1 | 27.75,70 27.75,69 R18.2 | v22,15.5 21.75,15.5 20,13.75 19,13.75 IC1.24 | v22,68 24,70 27.75,70
  Bottom 0.152: v22,68 v22,15.5
D6_BTN  (via drill 0.05)
  Top 0.152: R2.2 21.5,10.75 22.25,10.75 22.5,11 22.5,11.25 | 22.5,11.25 22.5,12.25 IC1.29 | v24.5,78 20.75,81.75 HP2.BTN | 22.5,11.25 v22.75,11.25
  Bottom 0.152: v24.5,78 24.5,23.1 24.6,23 24.6,21.75 24.5,21.65 24.5,13 v22.75,11.25
D9_TFTRST  (via drill 0.05)
  Top 0.152: v15.75,23.5 18,23.5 20.5,21 IC1.12 | v16.5,81 15.75,81.75 HP2.RST
  Bottom 0.152: v15.75,23.5 15.75,54.5 17.25,56 17.25,68 16.5,68.75 v16.5,81
D10_TFTCS  (via drill 0.05)
  Top 0.152: v20.25,11.25 21.5,11.25 21.5,12.25 IC1.27 | v11.5,81 10.5,82 HP2.CS
  Bottom 0.152: v20.25,11.25 13,18.5 13,68 11.5,69.5 v11.5,81
D11_TFTDC  (via drill 0.05)
  Top 0.152: v19.5,12.75 20.25,12.75 20.5,12.5 IC1.25 | v13,80.5 13,82 HP2.DC
  Bottom 0.152: v19.5,12.75 13.5,18.75 13.5,68 13,68.5 v13,80.5
D12_TO_ESC  (via drill 0.05)
  Top 0.152: v22,11.25 22,12.25 IC1.28 | v24.5,8.5 25,8 25.25,8 J2.1
  Bottom 0.152: v22,11.25 24.5,8.75 v24.5,8.5
D13
  Top 0.152: LED1.A 16,13.25 20,13.25 20.25,13.5 20.75,13.5 21,13.25 21,12.5 IC1.26
D+  (via drill 0.05)
  Top 0.152: D1.2 15.75,9 v18.25,9 26.25,9 26.75,9.5 26.75,13.25 26.5,13.25 26.25,13.5 25.25,13.5 25,13.25 25,12.5 IC1.34 | v18.25,5.5 18.25,4.5 J1.3
  Bottom 0.152: v18.25,9 v18.25,5.5
D-  (via drill 0.05)
  Top 0.152: 17.25,5.5 15,5.5 15,7.5 13.75,8.75 D1.3 | 17.25,5.5 17.75,5 17.75,4.5 J1.2 | v24.5,10 24.5,12.25 IC1.33 | v18.75,6.75 17.5,5.5 17.25,5.5
  Bottom 0.152: v24.5,10 25,9.5 25,8.25 23.5,6.75 v18.75,6.75
GND  (via drill 0.05)
  other vias: 32.15,10.75 32.6,10.75 33.6,20.45 29.8,63.45 28.95,58.65 17.25,25.3 26.15,16.3 29.75,16.05 25.4,11.15 27.8,9 27.6,64.6 26.2,65.95 16.6,6.15 19.05,6 23.75,22.55 20.25,16.75 19.25,60.2 12.5,59.7 27.45,48.75 25.5,46.6 30.5,21.1 33.05,10.75 33.5,10.75 33.95,10.75 34.4,10.75 36.75,13.6 36.3,13.6 35.85,13.6 35.4,13.6 34.95,13.6 34.5,13.6 34.5,13.15 34.05,13.15
  pour Top: 0,0 37.3,0 37.3,95 0,95
  pour Bottom: 0,0 37.3,0 37.3,95 0,95
MOSI  (via drill 0.05)
  Top 0.152: v17.75,16.25 18.75,16.25 IC1.19 | v16.75,85.5 15.75,85.5 HP2.MOSI
  Bottom 0.152: v17.75,16.25 16.75,17.25 16.75,54.5 18.75,56.5 18.75,68.25 19.25,68.75 19.25,83 v16.75,85.5
N$1
  Top 0.152: C6.1 28.75,17 28.5,16.75 27.5,16.75 IC1.43
N$2
  Top 0.152: R3.1 14.75,14.5 14.75,13.5 14.5,13.5 LED1.C
N$4
  Top 0.152: C4.1 29,26 29,23.75 Y1.2 28.75,23.5 28.5,23.5 26,21 IC1.1
N$6
  Top 0.152: C2.1 26.5,26 26.5,23.75 Y1.1 26.25,23.5 25.5,23.5 25.5,21 IC1.2
N$8
  Top 0.152: C10.1 19.25,27.25 20.5,26 20.5,25.5 FB.P$1 20.75,25.25 20.75,24.75 23.5,22 23.5,21 IC1.6
N$9
  Top 0.152: R4.2 27.25,56.5 27.25,54.5 R5.1 27.25,54.25 27.5,54 29.5,54 30.25,53.25 31,53.25 31.75,54 SWD1.P$10
N$10
  Top 0.152: 31,13 31,14.5 32,14.5 L1.1 | 31,13 31,12.75 C20.2 | 31,13 33.25,13 33.25,12.25 IC5.5
N$11
  Top 0.152: C20.1 31,11.75 31.25,12 32.25,12 IC5.6
N$14
  Top 0.152: R15.1 14.75,19.25 14.75,20.25 14.5,20.25 LED2.C
N$17  (via drill 0.05)
  Top 0.152: v16.75,60.75 17.75,60.75 IC4.OUT-
  Bottom 0.152: v16.75,60.75 15.75,59.75 15.75,56.5 LSP2.MP
N$24
  Top 0.152: C9.1 24.5,25.75 24.25,25.75 24.25,23.75 C14.1 24.25,23.5 24.5,23.5 24.5,21 IC1.4
N$25
  Top 0.152: R18.1 26.5,69 24.75,69 Q1.B
N$26
  Top 0.152: Q1.C 22.5,70 21.75,69.25 18.25,69.25 LS1.M
N$27
  Top 0.152: C15.1 11.5,61.5 11.75,61.25 13.5,61.25 IC4.REG
N$28
  Top 0.152: IC4.OUT+ 18,59.75 18.75,59.75 20.25,58.25 20.25,56.5 LSP1.MP
RST  (via drill 0.05)
  Top 0.152: 11.75,53.5 11.75,52 12.5,52 S3.P$4 | 11.75,53.5 11.75,54.5 R14.1 | 11.75,53.5 27,53.5 R5.2 27.25,53.25 v28.5,52 | v28.5,15.25 27.5,15.25 IC1.40
  Bottom 0.152: v28.5,15.25 28,15.75 28,31.75 28.5,32.25 v28.5,52
RX0_FROM_ESC  (via drill 0.05)
  Top 0.152: LED2.A 16,20.25 R1.1 17.5,20 v18.25,20 | v21.5,16.75 23.75,14.5 26.5,14.5 26.75,14.25 27.25,14.25 IC1.38 | v23.25,8.5 25,6.75 29.25,6.75 29.25,7.75 J2.5
  Bottom 0.152: v18.25,20 v21.5,16.75 21.5,10.25 v23.25,8.5
SCK  (via drill 0.05)
  Top 0.152: v17.25,15.75 18.75,15.75 IC1.20 | v17,84.5 18,85.5 HP2.SCK
  Bottom 0.152: v17.25,15.75 16.25,16.75 16.25,54.5 17.75,56 17.75,68 17,68.75 v17,84.5
SCL  (via drill 0.05)
  Top 0.152: IC2.2 27.5,65.5 26.25,66.75 25.75,66.75 R8.1 21.5,67.5 18.5,64.5 | v14.75,60.75 13.75,60.75 IC4.SCL | 18.5,64.5 v16.75,62.75 | R7.1 34,47 32.5,45.5 32,45.5 IC3.6 31.75,45.25 31.25,45.25 v24,38 | v24,14 24,12.5 IC1.32 | v24,59 18.5,64.5
  Bottom 0.152: v16.75,62.75 v14.75,60.75 | v24,14 24,21.7 24.25,21.95 24.25,22.7 24,22.95 v24,38 v24,59
SDA  (via drill 0.05)
  Top 0.152: IC2.4 27,64.75 26.75,64.75 26.5,64.5 26.5,62.75 26.75,62.75 R11.1 26.75,58.25 24.25,58.25 21.75,55.75 | 21.75,55.75 20.75,54.75 19.5,54.75 15.5,58.75 12.6,58.75 12.6,59.19 12.55,59.24 12.31,59.24 12.04,59.51 12.04,59.89 12.31,60.16 13.57,60.16 IC4.SDA | R16.1 34.25,44.25 32,44.25 IC3.5 31.75,44 30.75,44 v23.5,36.75 | v23.5,13.5 23.5,12.5 IC1.31 | 21.75,55.75 22.75,54.75 v23,54.75
  Bottom 0.152: v23.5,13.5 23.5,21.55 23.25,21.8 23.25,22.8 23.5,23.05 v23.5,36.75 23.5,54.25 v23,54.75
SH
  Top 0.152: C5.1 20,7.5 20,6.5 R9.2 20,6.25 20,5.25 20.75,4.5 J1.P$7
  Bottom 0.152: J1.P$8 15,1.75 15,3.5 15.75,4.25 J1.P$6 16,4.5 20.75,4.5 J1.P$7 21,4.25 21.75,3.5 21.75,1.75 J1.P$9
SWCLK  (via drill 0.05)
  Top 0.152: v29.5,17.75 27.5,17.75 IC1.45 | v34,55.75 32,57.75 SWD1.P$4
  Bottom 0.152: v29.5,17.75 34,22.25 v34,55.75
SWDIO  (via drill 0.05)
  Top 0.152: v28.5,18.25 27.5,18.25 IC1.46
  Bottom 0.152: v28.5,18.25 30,19.75 30,51 32.75,53.75 32.75,58.25 32,59 SWD1.P$2
TX1_TO_ESC  (via drill 0.05)
  Top 0.152: v27.5,12.5 27.5,13.75 IC1.37 | v31,9 29,9 28.5,8.5 28.5,8 J2.4
  Bottom 0.152: v31,9 v27.5,12.5
VBUS
  Top 0.152: J1.1 17.25,4.25 16.25,3.25 13.75,3.25 13.75,6.75 D1.4 13.5,7 13,7 13,9.25 13.25,9.5 16.75,9.5 17.5,10.25 D4.A

### Text on the board
tPlace: OpenPPG / SP140 | PCB Revision 3 | Buzzer | IC2 | - VIBE + | RESET | 3.3V | RX | 5V | D13 | PWM | 5V | GND | TX | RX | VIN
bPlace: OpenPPG